# EAGLE design lm324 (EAGLE 6.1)
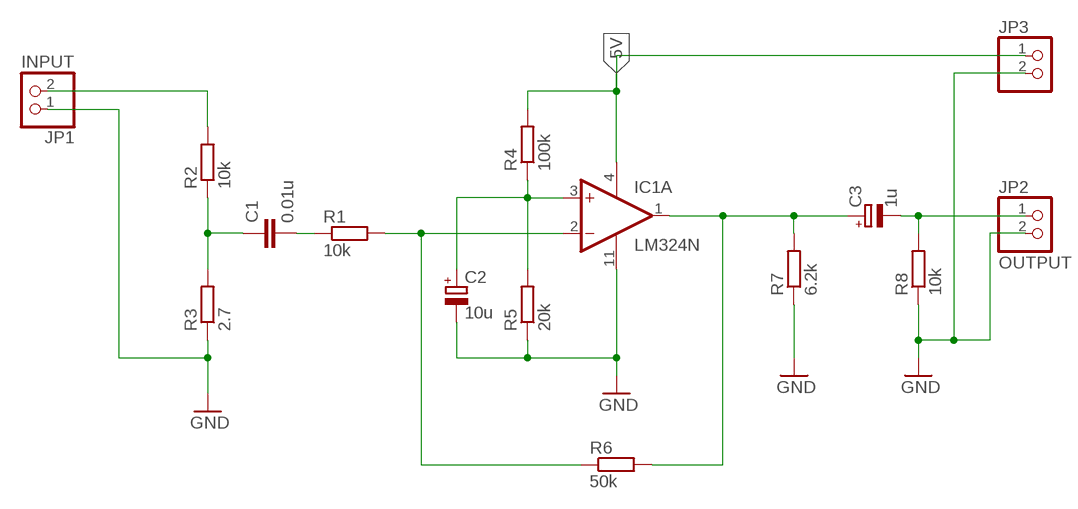
[diagram p0: schematic, sheet 1]

## Parts
C1  0.01u  C-EUC0805  [C0805]
C2  10u  CPOL-EUE3.5-8  [E3,5-8]
C3  1u  CPOL-EUE3.5-8  [E3,5-8]
IC1  LM324N  [DIL14]
JP1  INPUT  PINHD-1X2  [1X02]
JP2  OUTPUT  PINHD-1X2  [1X02]
JP3  PINHD-1X2  [1X02]
R1  10k  R-EU_R0805  [R0805]
R2  10k  R-EU_R0805  [R0805]
R3  2.7  R-EU_R0805  [R0805]
R4  100k  R-EU_R0805  [R0805]
R5  20k  R-EU_R0805  [R0805]
R6  50k  R-EU_R0805  [R0805]
R7  6.2k  R-EU_R0805  [R0805]
R8  10k  R-EU_R0805  [R0805]

## Nets
5V: IC1.4(P:V+) JP3.1 R4.2
GND: C2.- IC1.11(P:V-) JP1.1 JP2.2 JP3.2 R3.1 R5.1 R7.1 R8.1
N$1: IC1.2(A:-IN) R1.2 R6.1
N$2: C1.1 R2.1 R3.2
N$4: JP1.2 R2.2
N$5: C1.2 R1.1
N$6: C2.+ IC1.3(A:+IN) R4.1 R5.2
N$7: C3.+ IC1.1(A:OUT) R6.2 R7.2
N$8: C3.- JP2.1 R8.2
Unconnected: IC1.5(B:+IN) IC1.6(B:-IN) IC1.7(B:OUT) IC1.8(C:OUT) IC1.9(C:-IN) IC1.10(C:+IN) IC1.12(D:+IN) IC1.13(D:-IN) IC1.14(D:OUT)

## Library data of the parts
C1 = resistor:C-EU: CAPACITOR, European symbol
C2 C3 = resistor:CPOL-EU: POLARIZED CAPACITOR, European symbol
IC1 = linear:LM324: OP AMP
JP1-JP3 = pinhead:PINHD-1X2: PIN HEADER
R1-R8 = resistor:R-EU_: RESISTOR, European symbol

## Board
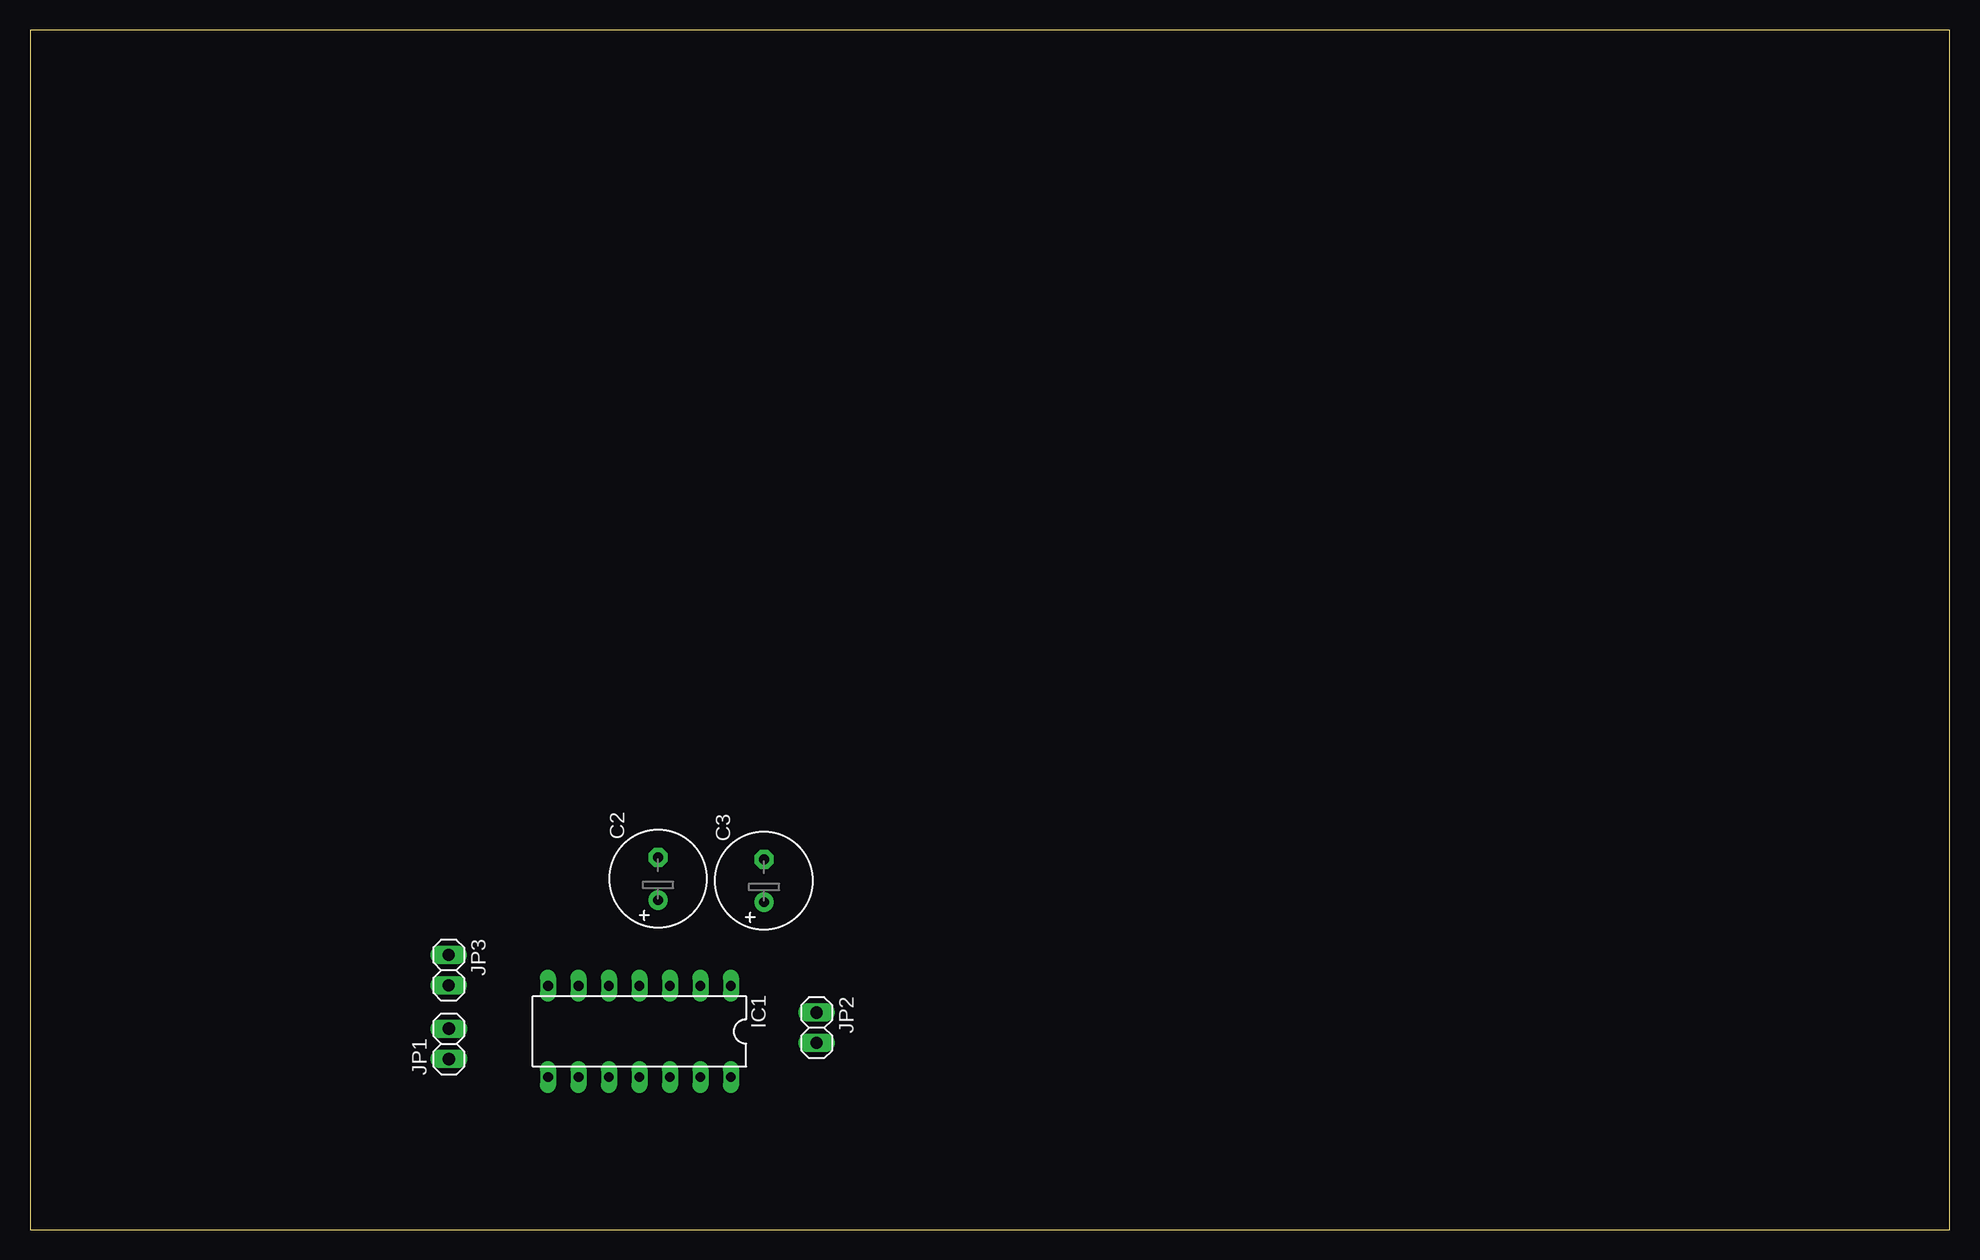
[diagram p1: board, top side]
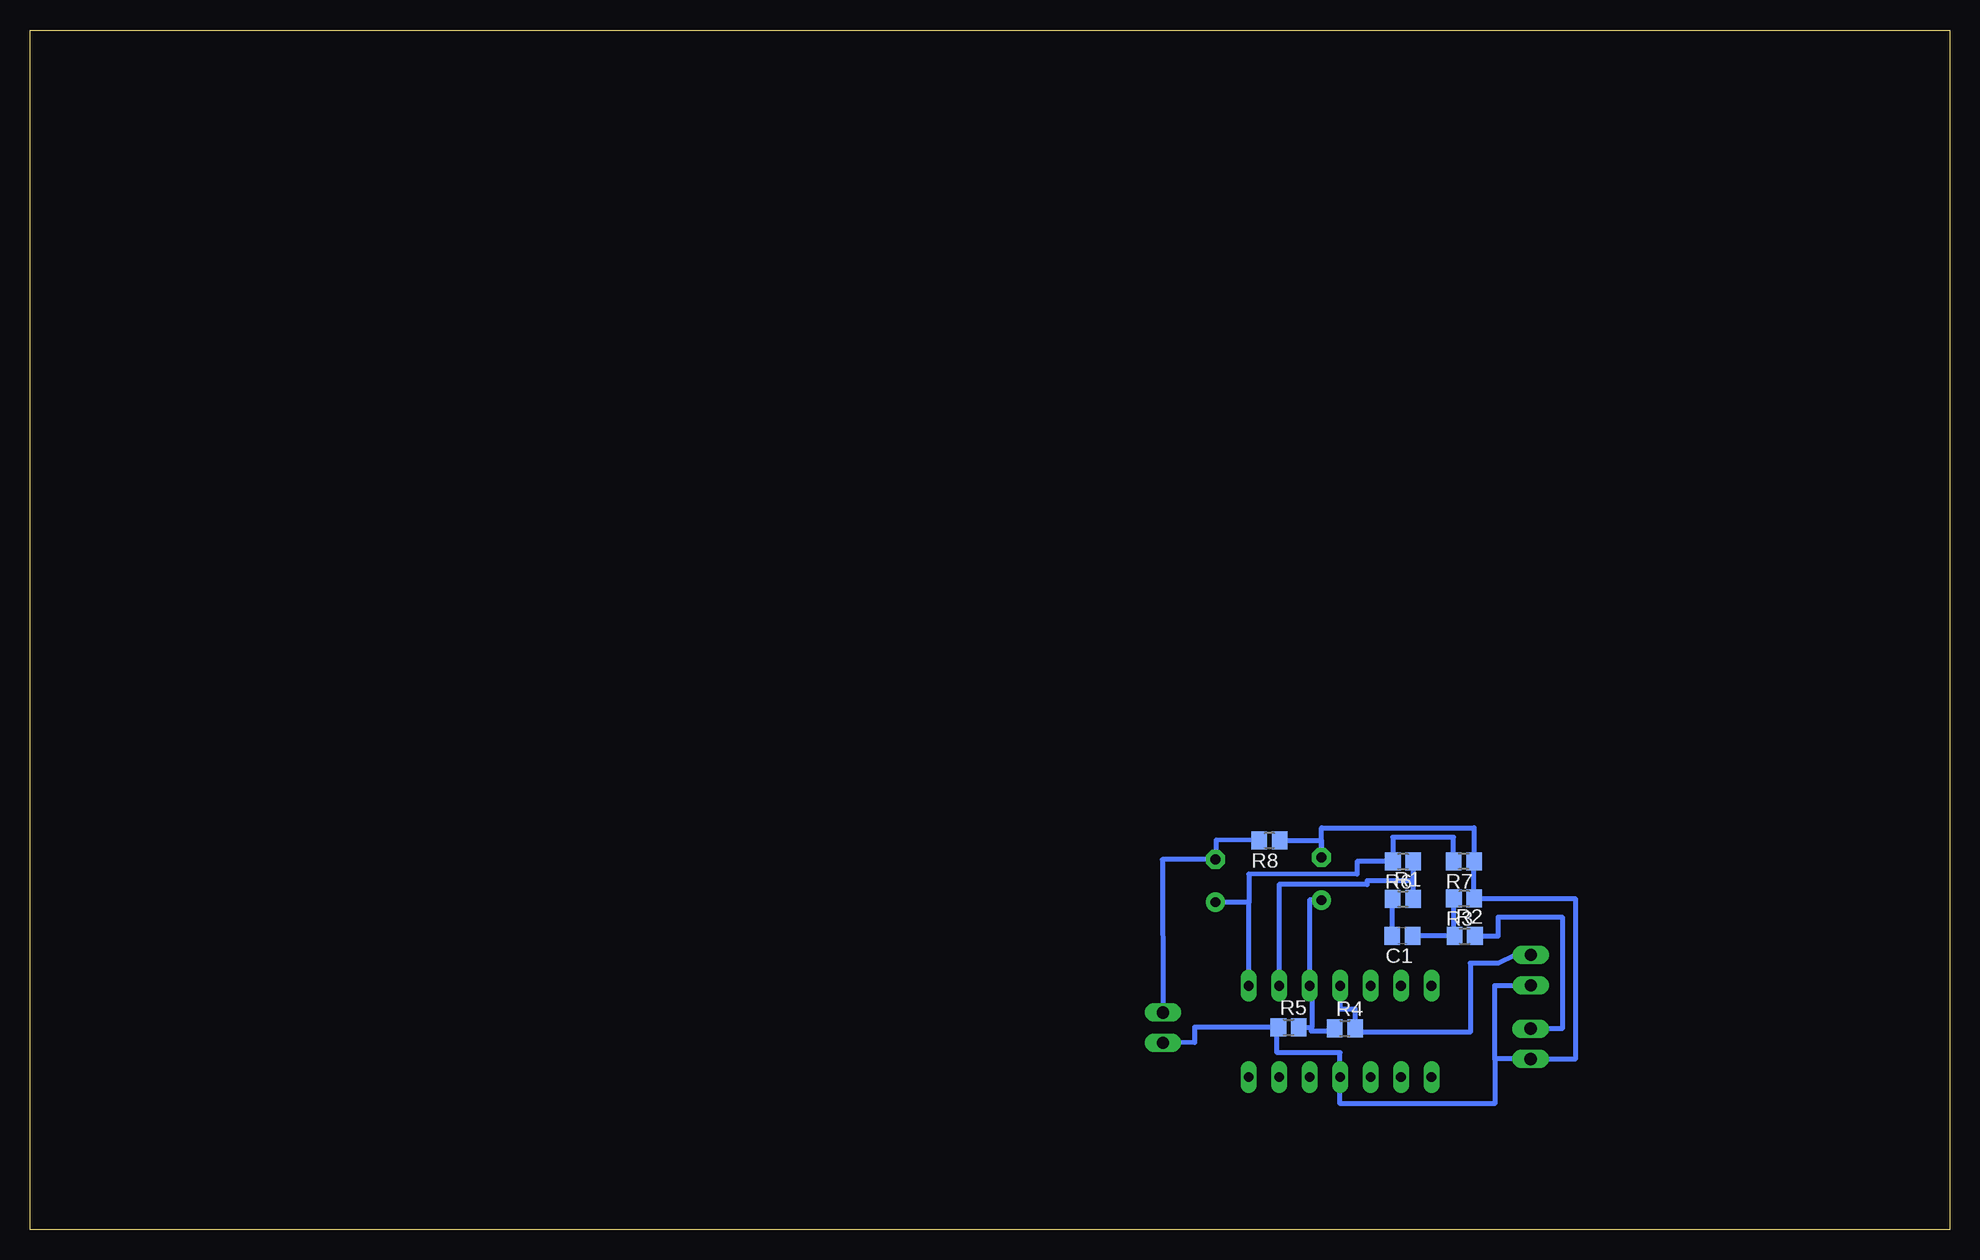
[diagram p2: board, bottom side, seen from below]

Size 160 x 100 mm. Coordinates in mm from the lower left corner, seen from the top.
Outline: 0,0 160,0 160,100 0,100 0,0
Copper layers (1*16): Top 0.035mm / dielectric 1.5mm / Bottom 0.035mm
Design rules: minimum track width 10mil, minimum drill 24mil, track to track 8mil, track to pad 8mil, pad to pad 8mil, via to via 8mil, smd to smd 8mil, copper to edge 40mil, drill to drill 8mil, minimum pad ring 10mil, minimum via ring 8mil, stop-mask expansion 4mil, vias tented up to drill 0mil, thermal gap 10mil

### Footprints (pad centres in the part's own frame; a part is rotated, then mirrored left to right if it is on the bottom)
C0805 = smd 1.3 x 1.5: 1 -0.85,0; 2 0.85,0
E3,5-8 = drill 0.813 pad 1.6: + -1.778,0 | drill 0.813 pad 1.6 octagon: - 1.778,0
DIL14 = drill 0.813 long: 1 -7.62,-3.81; 2 -5.08,-3.81; 3 -2.54,-3.81; 4 0,-3.81; 5 2.54,-3.81; 6 5.08,-3.81; 7 7.62,-3.81; 8 7.62,3.81; 9 5.08,3.81; 10 2.54,3.81; 11 0,3.81; 12 -2.54,3.81; 13 -5.08,3.81; 14 -7.62,3.81
1X02 = drill 1.016 long: 1 -1.27,0; 2 1.27,0
R0805 = smd 1.3 x 1.5: 1 -0.85,0; 2 0.85,0

### Placement (x,y rotation side)
C1  45.61,24.49 180 bottom
C2  52.35,29.24 90 top
C3  61.18,29.07 90 top
IC1  50.8,16.51 180 top
JP1  34.91,15.48 90 top
JP2  65.57,16.82 270 top
JP3  34.9,21.62 270 top
R1  45.56,27.56 0 bottom
R2  40.41,24.46 0 bottom
R3  40.46,27.59 180 bottom
R4  50.4,16.77 0 bottom
R5  55.09,16.86 0 bottom
R6  45.55,30.67 180 bottom
R7  40.49,30.69 180 bottom
R8  56.69,32.42 180 bottom

### Tracks (layer width: path | path; a pad name or v marks a point on that pad's centre or on a via)
5V
  Bottom 0.406: JP3.1 36.17,22.89 37.65,22.2 39.94,22.2 39.94,16.45 49.55,16.45 R4.2 49.55,18.4 50.81,18.4 IC1.4
GND
  Bottom 0.406: 37.9,14.21 JP1.1 31.19,14.2 31.19,27.59 R3.1 39.64,27.59 R7.1 39.64,33.5 52.35,33.5 C2.- 52.35,32.43 R8.1 | 37.9,14.21 37.91,20.34 35.06,20.34 JP3.2 | JP2.2 62.92,15.6 62.92,16.87 R5.1 56.05,16.55 56.05,14.75 50.8,14.75 IC1.11 50.8,10.48 37.9,10.48 37.9,14.21
N$1
  Bottom 0.406: 44.7,29.07 R1.2 44.7,29.07 | 44.7,29.07 R6.1 | 44.7,29.07 48.54,29.07 48.55,28.76 55.89,28.76 IC1.2
N$2
  Bottom 0.406: R2.1 41.75,24.46 | 41.75,24.46 41.75,24.44 41.31,24.44 R3.2 | 41.75,24.46 44.76,24.46 C1.1
N$4
  Bottom 0.406: R2.2 37.62,24.46 37.62,26.06 32.29,26.06 32.29,16.74 JP1.2
N$5
  Bottom 0.406: R1.1 46.46,27.56 C1.2
N$6
  Bottom 0.406: R5.2 53.19,16.86 | 53.19,16.86 53.16,16.86 53.15,20.32 IC1.3 53.34,27.46 C2.+ | 53.19,16.86 53.19,16.56 51.25,16.55 R4.1
N$7
  Bottom 0.406: R7.2 41.34,32.69 46.41,32.69 R6.2 49.38,30.67 49.39,29.61 58.41,29.64 58.38,27.29 61.18,27.27 C3.+ 58.42,27.26 IC1.1
N$8
  Bottom 0.406: R8.2 61.14,32.47 61.14,31.02 61.18,31.02 C3.- 65.62,30.85 JP2.1